# EAGLE design zapper (EAGLE 5.11)
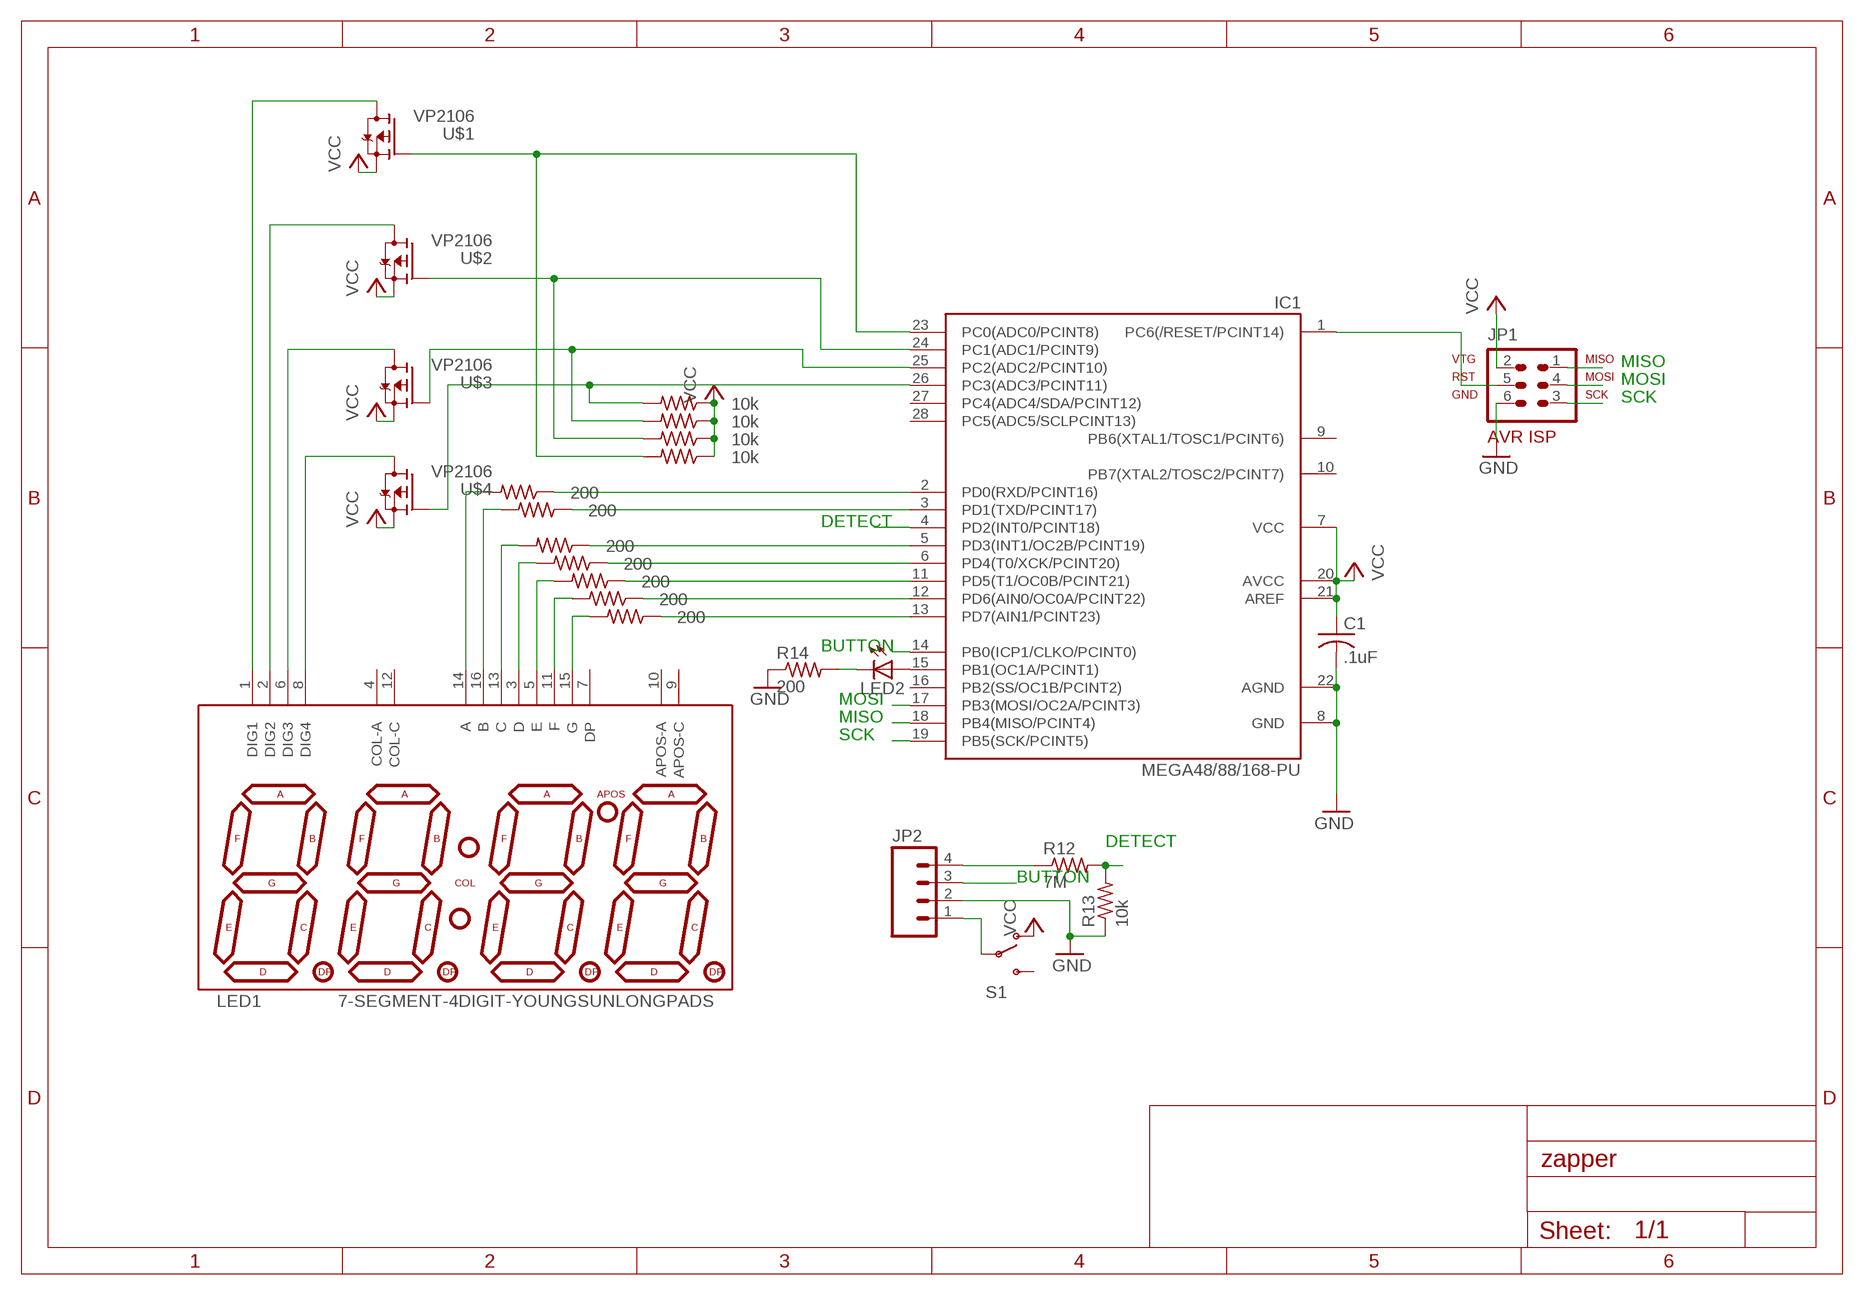
[diagram p0: schematic, sheet 1]

## Parts
C1  .1uF  C-US025-050X050  [C025-050X050]
IC1  MEGA48/88/168-PU  [DIL28-3]
JP1  AVR-ISP-6  [AVR-ISP-6]
JP2  M04SCREW_LOCK  [SCREWTERMINAL-3.5MM-4_LOCK]
LED1  7-SEGMENT-4DIGIT-YOUNGSUNLONGPADS  [7-SEGMENT-4DIGIT-YOUNGSUN-LONGPADS]
LED2  LED3MM  [LED3MM]
R1  200  R-US_0204/2V  [0204V]
R2  200  R-US_0204/2V  [0204V]
R3  200  R-US_0204/2V  [0204V]
R4  200  R-US_0204/2V  [0204V]
R5  200  R-US_0204/2V  [0204V]
R6  200  R-US_0204/2V  [0204V]
R7  200  R-US_0204/2V  [0204V]
R8  10k  R-US_0204/2V  [0204V]
R9  10k  R-US_0204/2V  [0204V]
R10  10k  R-US_0204/2V  [0204V]
R11  10k  R-US_0204/2V  [0204V]
R12  7M  R-US_0207/12  [0207/12]
R13  10k  R-US_0204/2V  [0204V]
R14  200  R-US_0204/2V  [0204V]
S1  SWITCH-SPSTKIT  [SWITCH-SPDT_KIT]
U$1  VP2106  [TO92]
U$2  VP2106  [TO92]
U$3  VP2106  [TO92]
U$4  VP2106  [TO92]

## Nets
BUTTON: IC1.14(PB0(ICP1/CLKO/PCINT0)) JP2.3
DETECT: IC1.4(PD2(INT0/PCINT18)) R12.2 R13.2
GND: C1.2 IC1.8(GND) IC1.22(AGND) JP1.6 JP2.2 R13.1 R14.1
MISO: IC1.18(PB4(MISO/PCINT4)) JP1.1
MOSI: IC1.17(PB3(MOSI/OC2A/PCINT3)) JP1.4
N$1: IC1.23(PC0(ADC0/PCINT8)) R11.2 U$1.2(G)
N$2: IC1.24(PC1(ADC1/PCINT9)) R10.2 U$2.2(G)
N$3: LED1.14(A) R1.2
N$4: LED1.15(G) R7.2
N$5: LED1.11(F) R6.2
N$6: LED1.5(E) R5.2
N$7: LED1.3(D) R4.2
N$8: LED1.13(C) R3.2
N$9: LED1.16(B) R2.2
N$10: IC1.13(PD7(AIN1/PCINT23)) R7.1
N$11: IC1.12(PD6(AIN0/OC0A/PCINT22)) R6.1
N$12: IC1.11(PD5(T1/OC0B/PCINT21)) R5.1
N$13: IC1.6(PD4(T0/XCK/PCINT20)) R4.1
N$14: IC1.5(PD3(INT1/OC2B/PCINT19)) R3.1
N$15: IC1.3(PD1(TXD/PCINT17)) R2.1
N$16: IC1.2(PD0(RXD/PCINT16)) R1.1
N$17: IC1.25(PC2(ADC2/PCINT10)) R9.2 U$3.2(G)
N$18: IC1.26(PC3(ADC3/PCINT11)) R8.2 U$4.2(G)
N$19: LED1.1(DIG1) U$1.1(D)
N$20: LED1.2(DIG2) U$2.1(D)
N$21: LED1.6(DIG3) U$3.1(D)
N$22: LED1.8(DIG4) U$4.1(D)
N$23: JP2.4 R12.1
N$24: IC1.15(PB1(OC1A/PCINT1)) LED2.A
N$25: LED2.K(C) R14.2
N$26: IC1.1(PC6(/RESET/PCINT14)) JP1.5
N$27: JP2.1 S1.2(P)
SCK: IC1.19(PB5(SCK/PCINT5)) JP1.3
VCC: C1.1 IC1.7(VCC) IC1.20(AVCC) IC1.21(AREF) JP1.2 R8.1 R9.1 R10.1 R11.1 S1.1(O) U$1.3(S) U$2.3(S) U$3.3(S) U$4.3(S)
Unconnected: IC1.9(PB6(XTAL1/TOSC1/PCINT6)) IC1.10(PB7(XTAL2/TOSC2/PCINT7)) IC1.16(PB2(SS/OC1B/PCINT2)) IC1.27(PC4(ADC4/SDA/PCINT12)) IC1.28(PC5(ADC5/SCLPCINT13)) LED1.4(COL-A) LED1.7(DP) LED1.9(APOS-C) LED1.10(APOS-A) LED1.12(COL-C) S1.3(S)

## Notes on the sheet
- MISO
- MOSI
- SCK
- DETECT
- BUTTON
- MOSI
- MISO
- SCK
- DETECT
- BUTTON

## Library data of the parts
C1 = rcl:C-US: CAPACITOR, American symbol
IC1 = avr-4:MEGA48/88/168-PU
JP1 = avr-4:AVR-ISP-6: AVR ISP-6 Serial Programming Header
JP2 = SparkFun:M04: Header 4 Standard 4-pin 0.1" header. Use with straight break away headers (SKU : PRT-00116), right angle break away headers (PRT-00553), swiss pins (PRT-00743), machine pins (PRT-00117), and female headers (PRT-00115). Molex polarized connector foot print use with SKU : PRT-08231 with associated crimp pins and housings. 1MM SMD Version SKU: PRT-10208
LED1 = SparkFun:7-SEGMENT-4DIGIT-YOUNGSUN: This is a part for the 4-Digit 7-segment LEDs from Young Sun. Different from the Digikey LEDs, all 16 pins are used. The LONGPADS Variant is used for a test jig, but you may like it because there is more pad to solder to. If you are concerned about routing space, the standard works just fine though.
LED2 = SparkFun:LED: LEDs Standard schematic elements and footprints for 5mm, 3mm, 1206, and 0603 sized LEDs. 5mm - Spark Fun Electronics SKU : COM-00529 (and others)
R1-R14 = rcl:R-US_: RESISTOR, American symbol
S1 = SparkFun:SWITCH-SPST: SPST Switch Simple slide switch. Spark Fun Electronics SKU : COM-00102
U$1-U$4 = transistor-fet:VP2106

## Board
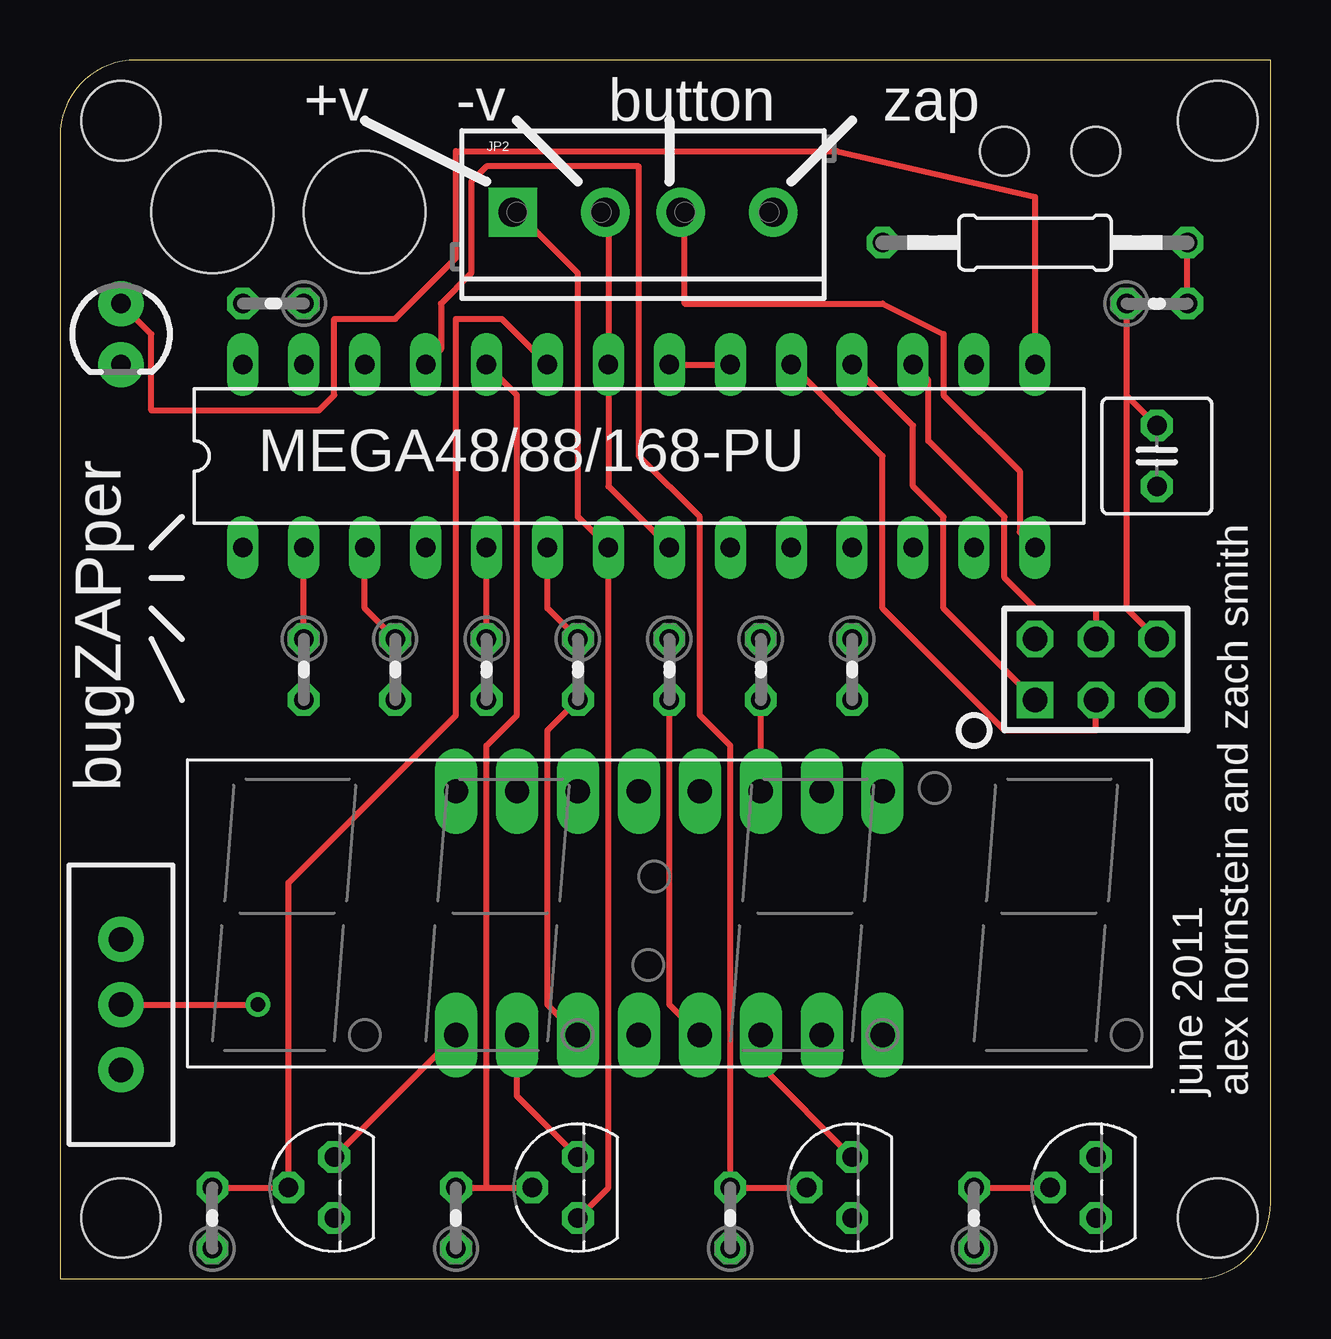
[diagram p1: board, top side]
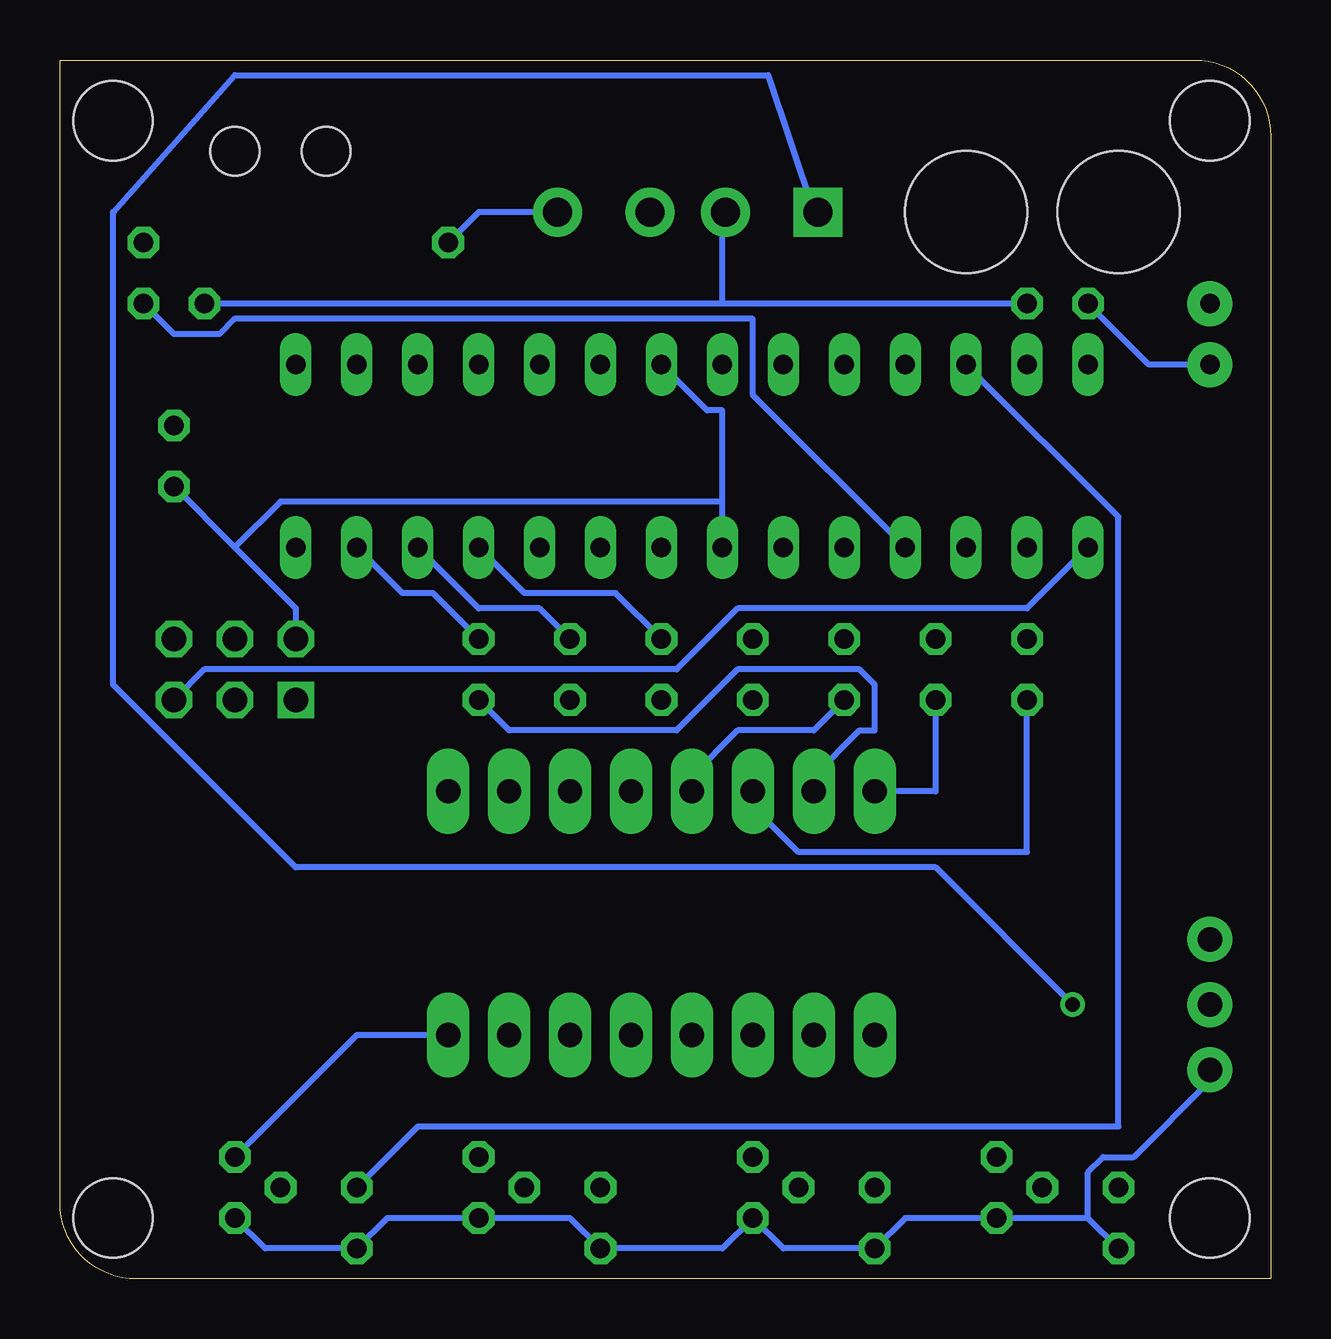
[diagram p2: board, bottom side, seen from below]

Size 50.47 x 50.79 mm. Coordinates in mm from the lower left corner, seen from the top.
Outline: 0,0 47.3,0 arc90 50.47,3.17 50.47,50.79 3.17,50.79 arc90 0,47.62 0,0
Copper layers (1*16): Top 0.035mm / dielectric 1.5mm / Bottom 0.035mm
Design rules "default": minimum track width 10mil, minimum drill 24mil, track to track 8mil, track to pad 8mil, pad to pad 8mil, via to via 8mil, smd to smd 8mil, copper to edge 40mil, drill to drill 8mil, minimum pad ring 10mil, minimum via ring 8mil, stop-mask expansion 4mil, vias tented up to drill 0mil, thermal gap 10mil
Holes 3.3 mm at 2.54,48.26 48.26,48.26 48.26,2.54 2.54,2.54
Holes 2.03 mm at 39.37,46.99 43.18,46.99
Holes 5.08 mm at 6.35,44.45 12.7,44.45

### Footprints (pad centres in the part's own frame; a part is rotated, then mirrored left to right if it is on the bottom)
C025-050X050 = drill 0.813 octagon: 1 -1.27,0; 2 1.27,0
DIL28-3 = drill 0.813 long: 1 -16.51,-3.81; 2 -13.97,-3.81; 3 -11.43,-3.81; 4 -8.89,-3.81; 5 -6.35,-3.81; 6 -3.81,-3.81; 7 -1.27,-3.81; 8 1.27,-3.81; 9 3.81,-3.81; 10 6.35,-3.81; 11 8.89,-3.81; 12 11.43,-3.81; 13 13.97,-3.81; 14 16.51,-3.81; 15 16.51,3.81; 16 13.97,3.81; 17 11.43,3.81; 18 8.89,3.81; 19 6.35,3.81; 20 3.81,3.81; 21 1.27,3.81; 22 -1.27,3.81; 23 -3.81,3.81; 24 -6.35,3.81; 25 -8.89,3.81; 26 -11.43,3.81; 27 -13.97,3.81; 28 -16.51,3.81
AVR-ISP-6 = drill 1.016 square: 1 -2.54,-1.27 | drill 1.016 octagon: 2 -2.54,1.27; 3 0,-1.27; 4 0,1.27; 5 2.54,-1.27; 6 2.54,1.27
SCREWTERMINAL-3.5MM-4_LOCK = drill 1.2 pad 2.032 square: 1 -0.178,0 | drill 1.2 pad 2.032 round: 2 3.678,0; 3 6.822,0; 4 10.678,0
7-SEGMENT-4DIGIT-YOUNGSUN-LONGPADS = drill 1.016 pad 1.778 long: 1 -8.89,-5.08; 2 -6.35,-5.08; 3 -3.81,-5.08; 4 -1.27,-5.08; 5 1.27,-5.08; 6 3.81,-5.08; 7 6.35,-5.08; 8 8.89,-5.08; 9 8.89,5.08; 10 6.35,5.08; 11 3.81,5.08; 12 1.27,5.08; 13 -1.27,5.08; 14 -3.81,5.08; 15 -6.35,5.08; 16 -8.89,5.08
LED3MM = drill 0.813 pad 1.88 round: A -1.27,0; K 1.27,0
0204V = drill 0.813 octagon: 1 -1.27,0; 2 1.27,0
0207/12 = drill 0.813 octagon: 1 -6.35,0; 2 6.35,0
SWITCH-SPDT_KIT = drill 1.016 pad 1.88 round: 1 0,2.718; 2 0,0; 3 0,-2.718
TO92 = drill 0.813 octagon: 1 1.27,0; 2 0,1.905; 3 -1.27,0

### Placement (x,y rotation side)
C1  45.72,34.29 90 top
IC1  24.13,34.29 0 top
JP1  43.18,25.4 0 top
JP2  19.05,44.45 0 top
LED1  25.4,15.24 0 top
LED2  2.54,39.37 270 top
R1  10.16,25.4 270 top
R2  13.97,25.4 270 top
R3  17.78,25.4 270 top
R4  21.59,25.4 270 top
R5  25.4,25.4 270 top
R6  29.21,25.4 270 top
R7  33.02,25.4 270 top
R8  38.1,2.54 90 top
R9  27.94,2.54 90 top
R10  16.51,2.54 90 top
R11  6.35,2.54 90 top
R12  40.64,43.18 0 top
R13  45.72,40.64 0 top
R14  8.89,40.64 180 top
S1  2.54,11.43 180 top
U$1  11.43,3.81 90 top
U$2  21.59,3.81 90 top
U$3  33.02,3.81 90 top
U$4  43.18,3.81 90 top

### Tracks (layer width: path | path; a pad name or v marks a point on that pad's centre or on a via)
BUTTON
  Top 0.254: IC1.14 40.01,31.11 40.01,33.66 36.83,36.83 36.83,39.37 34.29,40.64 26.04,40.64 26.04,44.45 JP2.3
DETECT
  Top 0.254: R13.2 R12.2
  Bottom 0.254: IC1.4 21.59,36.83 21.59,40.01 43.18,40.01 43.81,39.37 45.72,39.37 R13.2
GND
  Top 0.254: 44.45,36.83 C1.2 | R13.1 44.45,36.83 | JP1.6 44.45,27.94 44.45,36.83 | JP2.2 22.86,44.45 IC1.22 22.86,33.02 IC1.8
  Bottom 0.254: 22.86,40.64 22.86,44.45 JP2.2 | R14.1 22.86,40.64 | 22.86,40.64 R13.1
MISO
  Top 0.254: IC1.18 35.56,35.56 35.56,33.02 36.83,31.75 36.83,27.94 JP1.1
MOSI
  Top 0.254: IC1.17 36.2,37.47 36.2,34.92 39.37,31.75 39.37,29.21 40.64,27.94 43.18,27.94 JP1.4
N$1
  Top 0.254: R11.2 U$1.2 9.53,16.51 16.51,23.5 16.51,40.01 18.41,40.01 IC1.23
N$2
  Top 0.254: 17.78,3.81 U$2.2 | R10.2 17.78,3.81 | IC1.24 19.05,36.83 19.05,23.5 17.78,22.23 17.78,3.81
N$3
  Bottom 0.254: R1.2 10.16,17.78 19.68,17.78 21.59,19.68 LED1.14
N$4
  Bottom 0.254: R7.2 31.75,22.86 24.77,22.86 22.23,25.4 17.14,25.4 16.51,24.77 16.51,22.86 17.14,22.86 19.05,20.95 LED1.15
N$5
  Top 0.254: LED1.11 R6.2
N$6
  Top 0.254: R5.2 25.4,11.43 LED1.5
N$7
  Top 0.254: R4.2 20.32,22.86 20.32,11.43 LED1.3
N$8
  Bottom 0.254: R3.2 19.05,22.86 22.23,22.86 24.13,20.95 LED1.13
N$9
  Bottom 0.254: R2.2 13.97,20.32 LED1.16
N$10
  Bottom 0.254: R7.1 34.92,28.57 36.2,28.57 IC1.13
N$11
  Bottom 0.254: R6.1 30.48,27.94 33.02,27.94 IC1.12
N$12
  Bottom 0.254: R5.1 27.3,28.57 31.11,28.57 IC1.11
N$13
  Top 0.254: R4.1 20.32,27.94 IC1.6
N$14
  Top 0.254: R3.1 IC1.5
N$15
  Top 0.254: R2.1 12.7,27.94 IC1.3
N$16
  Top 0.254: R1.1 IC1.2
N$17
  Top 0.254: U$3.2 R9.2 27.94,22.23 26.67,23.5 26.67,31.75 24.13,34.29 24.13,46.35 17.78,46.35 17.14,45.72 17.14,41.91 15.88,40.64 15.88,38.73 IC1.25
N$18
  Top 0.254: R8.2 U$4.2
  Bottom 0.254: IC1.26 6.35,31.75 6.35,6.35 35.56,6.35 R8.2
N$19
  Top 0.254: U$1.1 LED1.1
N$20
  Top 0.254: U$2.1 19.05,7.62 LED1.2
N$21
  Top 0.254: U$3.1 29.21,8.89 LED1.6
N$22
  Bottom 0.254: U$4.1 38.1,10.16 LED1.8
N$23
  Bottom 0.254: R12.1 33.02,44.45 JP2.4
N$24
  Top 0.254: IC1.15 40.64,45.09 32.38,46.99 16.51,46.99 16.51,42.55 13.97,40.01 11.43,40.01 11.43,36.83 10.79,36.2 3.81,36.2 3.81,39.37 LED2.A
N$25
  Bottom 0.254: R14.2 5.08,38.1 LED2.K
N$26
  Bottom 0.254: IC1.1 10.16,27.94 22.23,27.94 24.77,25.4 44.45,25.4 JP1.5
N$27  (via drill 0.61)
  Top 0.254: S1.2 v8.26,11.43
  Bottom 0.254: v8.26,11.43 13.97,17.14 40.64,17.14 48.26,24.77 48.26,44.45 43.18,50.16 20.95,50.16 19.05,44.45 JP2.1
SCK
  Top 0.254: IC1.19 34.29,34.29 34.29,27.94 39.37,22.86 43.18,22.86 JP1.3
VCC
  Top 0.254: IC1.21 IC1.20 | 19.05,44.45 21.59,41.91 21.59,31.75 IC1.7 22.86,3.81 U$2.3
  Bottom 0.254: R11.1 7.62,2.54 | 7.62,2.54 U$1.3 15.24,2.54 R10.1 20.32,1.27 U$2.3 22.86,1.27 R9.1 29.21,2.54 U$3.3 36.83,2.54 R8.1 41.91,1.27 U$4.3 | 43.18,30.48 40.64,27.94 JP1.2 | 43.18,30.48 C1.1 | 22.86,32.38 22.86,36.2 23.5,36.2 IC1.21 | IC1.7 22.86,32.38 | 43.18,30.48 41.27,32.38 22.86,32.38 | 7.62,2.54 7.62,4.45 6.99,5.08 5.71,5.08 2.54,8.26 S1.1

### Text on the board
tPlace: +v | -v | button | zap | bugZAPper | june 2011 | alex hornstein and zach smith